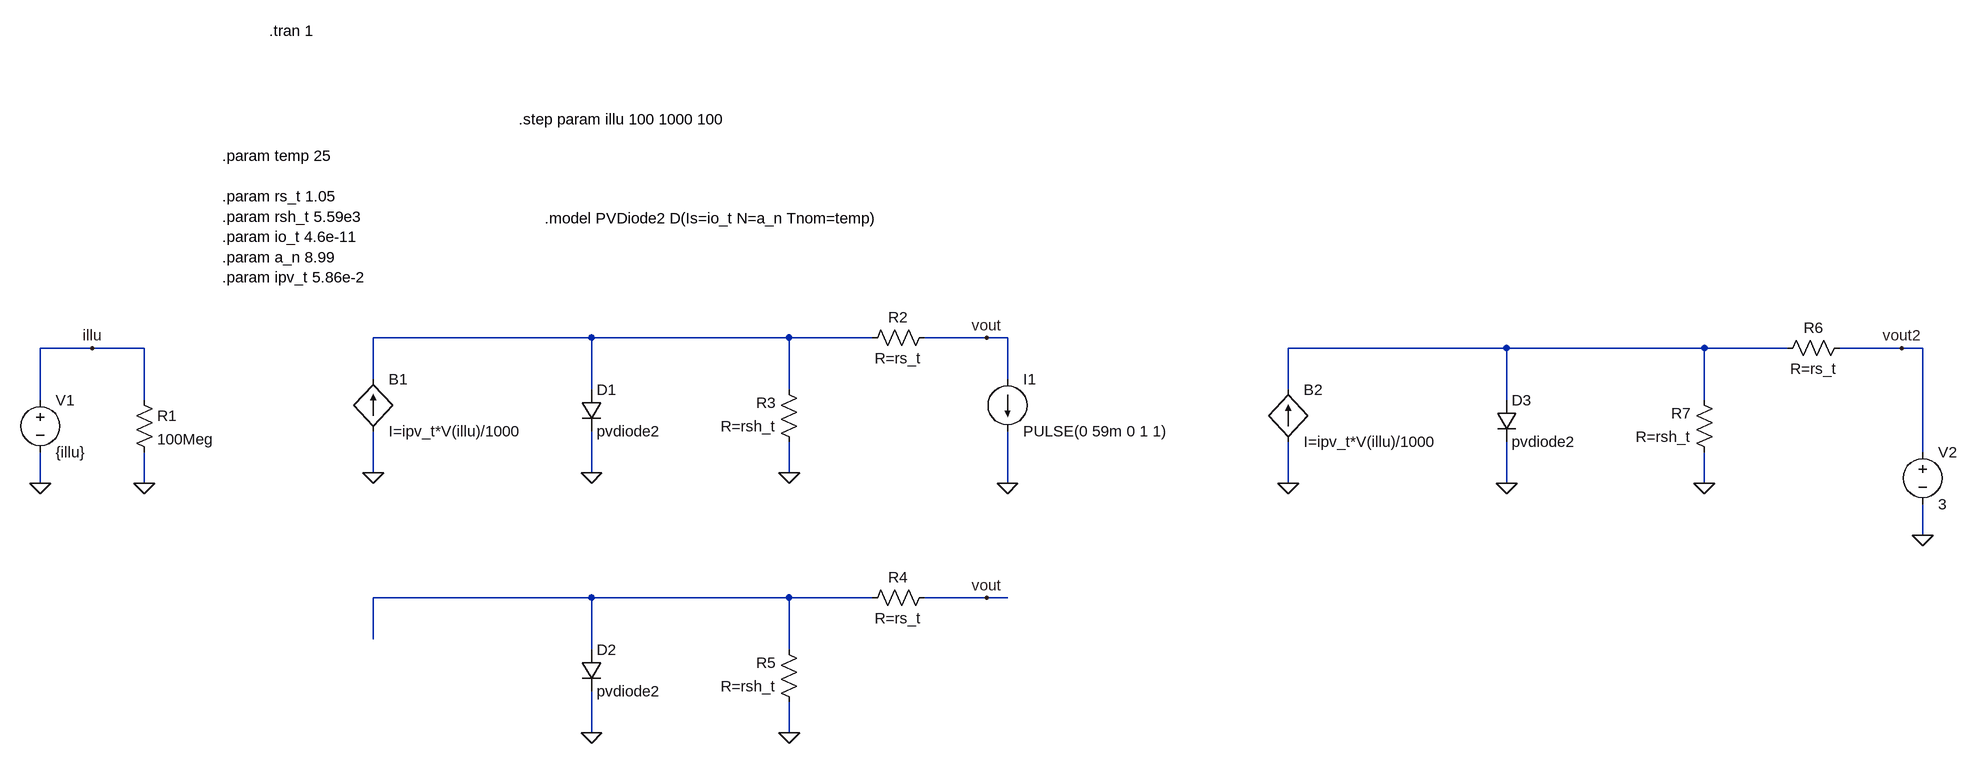
[diagram p0: schematic SM141K07L_Model.asc]
SM141K07L_Model.asc, the LTspice schematic file:
Version 4
SHEET 1 3284 756
WIRE 976 80 640 80
WIRE 1280 80 976 80
WIRE 1408 80 1280 80
WIRE 1584 80 1488 80
WIRE 1616 80 1584 80
WIRE 208 96 128 96
WIRE 288 96 208 96
WIRE 2384 96 2048 96
WIRE 2688 96 2384 96
WIRE 2816 96 2688 96
WIRE 2992 96 2896 96
WIRE 3024 96 2992 96
WIRE 640 144 640 80
WIRE 1616 144 1616 80
WIRE 976 160 976 80
WIRE 1280 160 1280 80
WIRE 2048 160 2048 96
WIRE 128 176 128 96
WIRE 288 176 288 96
WIRE 2384 176 2384 96
WIRE 2688 176 2688 96
WIRE 3024 256 3024 96
WIRE 640 288 640 224
WIRE 976 288 976 224
WIRE 1280 288 1280 240
WIRE 128 304 128 256
WIRE 288 304 288 256
WIRE 1616 304 1616 224
WIRE 2048 304 2048 240
WIRE 2384 304 2384 240
WIRE 2688 304 2688 256
WIRE 3024 384 3024 336
WIRE 976 480 640 480
WIRE 1280 480 976 480
WIRE 1408 480 1280 480
WIRE 1584 480 1488 480
WIRE 1616 480 1584 480
WIRE 640 544 640 480
WIRE 976 560 976 480
WIRE 1280 560 1280 480
WIRE 976 688 976 624
WIRE 1280 688 1280 640
FLAG 128 304 0
FLAG 288 304 0
FLAG 208 96 illu
FLAG 1616 304 0
FLAG 1280 288 0
FLAG 976 288 0
FLAG 640 288 0
FLAG 1584 80 vout
FLAG 1280 688 0
FLAG 976 688 0
FLAG 1584 480 vout
FLAG 2688 304 0
FLAG 2384 304 0
FLAG 2048 304 0
FLAG 2992 96 vout2
FLAG 3024 384 0
SYMBOL voltage 128 160 R0
SYMATTR InstName V1
SYMATTR Value {illu}
SYMBOL res 272 160 R0
SYMATTR InstName R1
SYMATTR Value 100Meg
SYMBOL current 1616 144 R0
WINDOW 123 0 0 Left 0
WINDOW 39 0 0 Left 0
SYMATTR InstName I1
SYMATTR Value PULSE(0 59m 0 1 1)
SYMBOL res 1504 64 R90
WINDOW 0 0 56 VBottom 2
WINDOW 3 32 56 VTop 2
SYMATTR InstName R2
SYMATTR Value R=rs_t
SYMBOL res 1296 256 R180
WINDOW 0 36 76 Left 2
WINDOW 3 36 40 Left 2
SYMATTR InstName R3
SYMATTR Value R=rsh_t
SYMBOL diode 960 160 R0
SYMATTR InstName D1
SYMATTR Value pvdiode2
SYMBOL bi2 640 144 R0
SYMATTR InstName B1
SYMATTR Value I=ipv_t*V(illu)/1000
SYMBOL res 1504 464 R90
WINDOW 0 0 56 VBottom 2
WINDOW 3 32 56 VTop 2
SYMATTR InstName R4
SYMATTR Value R=rs_t
SYMBOL res 1296 656 R180
WINDOW 0 36 76 Left 2
WINDOW 3 36 40 Left 2
SYMATTR InstName R5
SYMATTR Value R=rsh_t
SYMBOL diode 960 560 R0
SYMATTR InstName D2
SYMATTR Value pvdiode2
SYMBOL res 2912 80 R90
WINDOW 0 0 56 VBottom 2
WINDOW 3 32 56 VTop 2
SYMATTR InstName R6
SYMATTR Value R=rs_t
SYMBOL res 2704 272 R180
WINDOW 0 36 76 Left 2
WINDOW 3 36 40 Left 2
SYMATTR InstName R7
SYMATTR Value R=rsh_t
SYMBOL diode 2368 176 R0
SYMATTR InstName D3
SYMATTR Value pvdiode2
SYMBOL bi2 2048 160 R0
SYMATTR InstName B2
SYMATTR Value I=ipv_t*V(illu)/1000
SYMBOL voltage 3024 240 R0
WINDOW 123 0 0 Left 0
WINDOW 39 0 0 Left 0
SYMATTR InstName V2
SYMATTR Value 3
TEXT 904 -104 Left 2 !.model PVDiode2 D(Is=io_t N=a_n Tnom=temp)
TEXT 408 -200 Left 2 !.param temp 25\n \n.param rs_t 1.05\n.param rsh_t 5.59e3\n.param io_t 4.6e-11\n.param a_n 8.99\n.param ipv_t 5.86e-2
TEXT 864 -256 Left 2 !.step param illu 100 1000 100
TEXT 480 -392 Left 2 !.tran 1

The netlist it stands for:
* SM141K07L_Model.asc
V1 illu 0 {illu}
R1 illu 0 100Meg
I1 vout 0 PULSE(0 59m 0 1 1)
R2 vout N001 R=rs_t
R3 0 N001 R=rsh_t
D1 N001 0 pvdiode2
B1 0 N001 I=ipv_t*V(illu)/1000
R4 vout N003 R=rs_t
R5 0 N003 R=rsh_t
D2 N003 0 pvdiode2
R6 vout2 N002 R=rs_t
R7 0 N002 R=rsh_t
D3 N002 0 pvdiode2
B2 0 N002 I=ipv_t*V(illu)/1000
V2 vout2 0 3
.model D D
.lib standard.dio
.model PVDiode2 D(Is=io_t N=a_n Tnom=temp)
.param temp 25
.param rs_t 1.05
.param rsh_t 5.59e3
.param io_t 4.6e-11
.param a_n 8.99
.param ipv_t 5.86e-2
.step param illu 100 1000 100
.tran 1
.backanno
.end